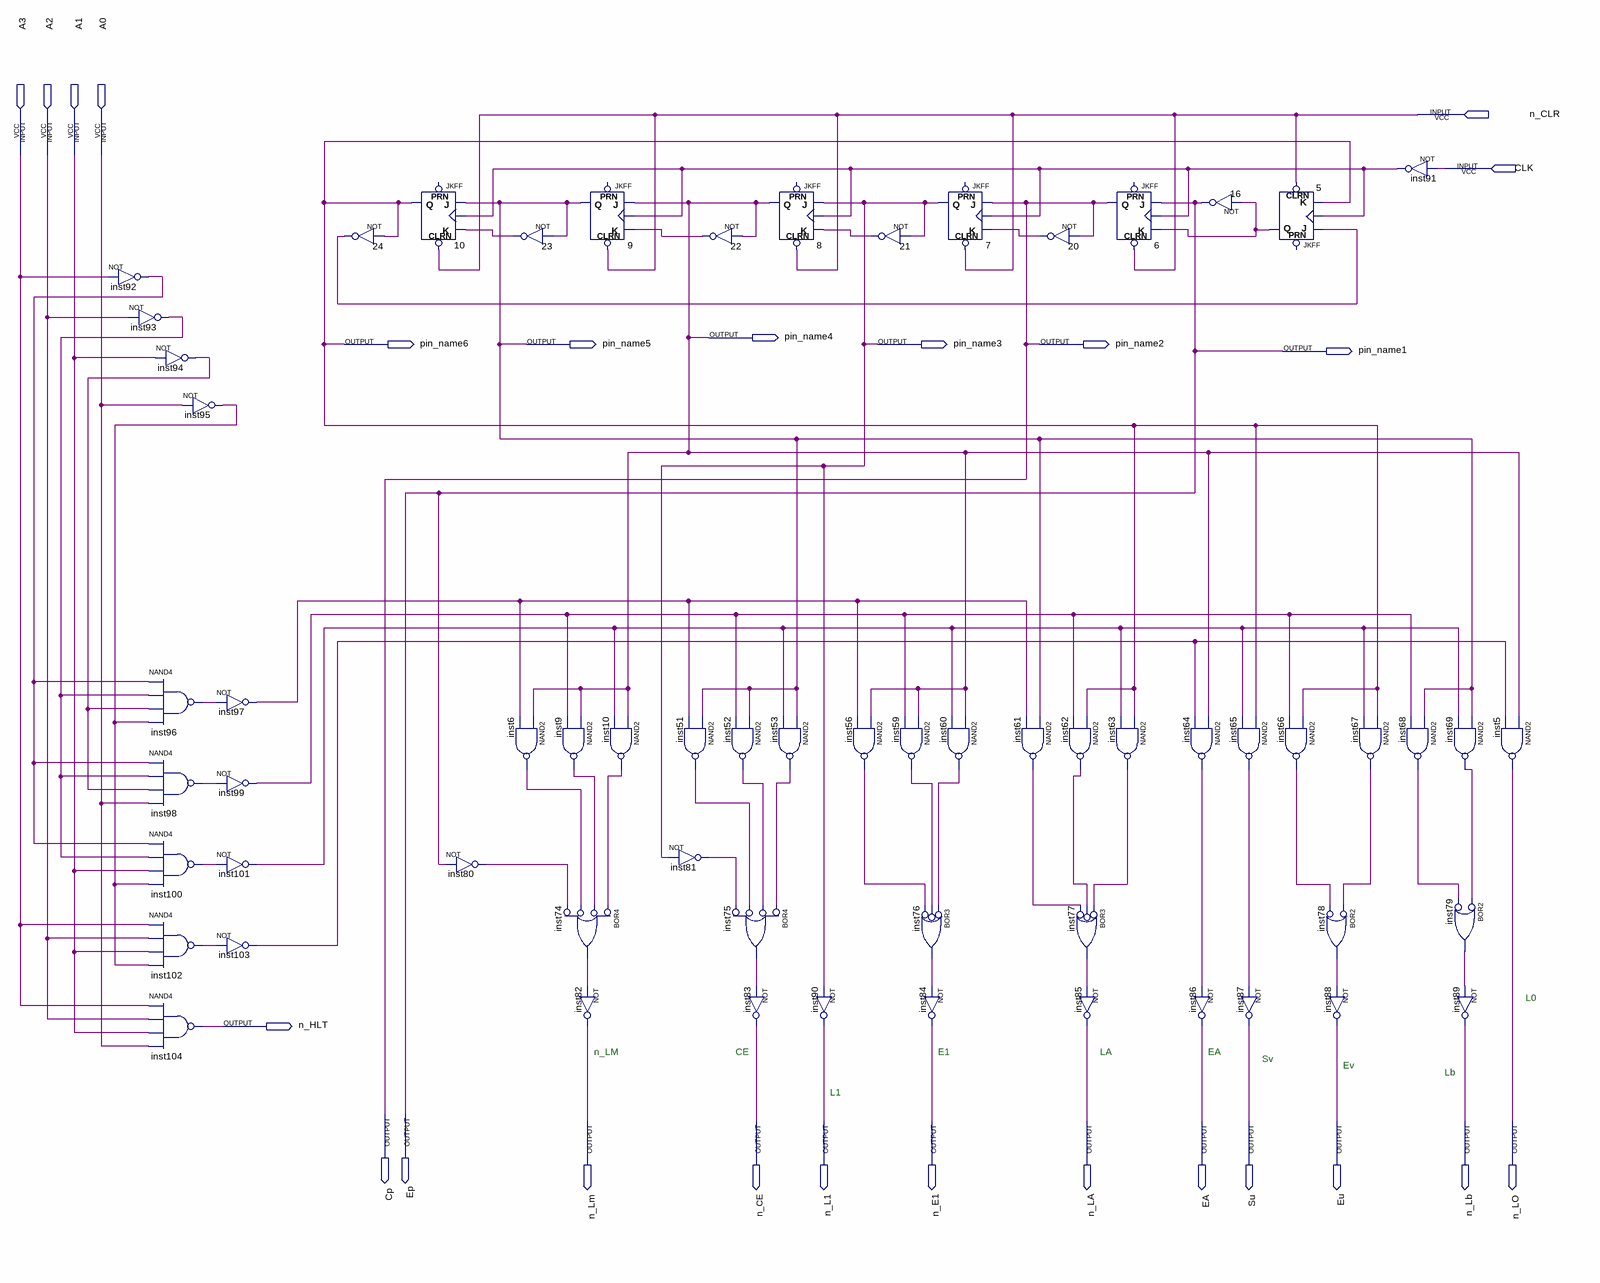
[diagram p0: schematic sheet]
// Quartus schematic CONTROLADOR.bdf as structural Verilog: 62 symbols, 25 pins
module CONTROLADOR (
  input  n_CLR,
  input  A3,
  input  A2,
  input  A1,
  input  A0,
  input  CLK,
  output pin_name4,
  output pin_name6,
  output pin_name5,
  output pin_name3,
  output pin_name2,
  output pin_name1,
  output n_HLT,
  output Cp,
  output Ep,
  output n_Lm,
  output n_CE,
  output n_L1,
  output n_E1,
  output n_LA,
  output EA,
  output Su,
  output Eu,
  output n_Lb,
  output n_LO
);

  wire inst6_out, inst9_out, inst10_out, inst51_out, inst52_out, inst53_out, inst56_out, inst59_out,
       inst60_out, inst61_out, inst62_out, inst63_out, inst64_out, inst65_out, inst66_out, inst67_out,
       inst68_out, inst69_out, inst74_out, inst75_out, inst76_out, inst77_out, inst78_out, inst79_out,
       inst80_out, inst81_out, inst91_out, inst92_out, inst93_out, inst94_out, inst95_out, inst96_out,
       inst97_out, inst98_out, inst99_out, inst100_out, inst101_out, inst102_out, inst103_out, n5_q, n20_out,
       n21_out, n22_out, n23_out, n24_out;

  not inst92 (inst92_out, A3);
  not inst93 (inst93_out, A2);
  not inst94 (inst94_out, A1);
  nand inst96 (inst96_out, inst92_out, inst93_out, inst94_out, inst95_out);
  nand inst98 (inst98_out, inst92_out, inst93_out, inst94_out, A0);
  nand inst100 (inst100_out, inst92_out, inst93_out, A1, inst95_out);
  nand inst102 (inst102_out, A3, A2, A1, inst95_out);
  nand inst104 (n_HLT, A3, A2, A1, A0);
  not inst95 (inst95_out, A0);
  not inst97 (inst97_out, inst96_out);
  not inst99 (inst99_out, inst98_out);
  not inst101 (inst101_out, inst100_out);
  not inst103 (inst103_out, inst102_out);
  not u_24 (n24_out, pin_name6);
  JKFF u_10 (.CLRN(n_CLR), .K(n23_out), .J(pin_name5), .CLK(inst91_out), .Q(pin_name6));  // open: PRN
  not inst80 (inst80_out, Ep);
  not u_23 (n23_out, pin_name5);
  nand inst6 (inst6_out, pin_name4, inst97_out);
  JKFF u_9 (.CLRN(n_CLR), .K(n22_out), .J(pin_name4), .CLK(inst91_out), .Q(pin_name5));  // open: PRN
  nand inst9 (inst9_out, pin_name4, inst99_out);
  nand inst10 (inst10_out, pin_name4, inst101_out);
  or inst74 (inst74_out, ~inst10_out, ~inst9_out, ~inst6_out, ~inst80_out);  // BOR4
  not inst82 (n_Lm, inst74_out);
  not u_22 (n22_out, pin_name4);
  nand inst51 (inst51_out, pin_name5, inst97_out);
  not inst81 (inst81_out, pin_name3);
  nand inst52 (inst52_out, pin_name5, inst99_out);
  or inst75 (inst75_out, ~inst53_out, ~inst52_out, ~inst51_out, ~inst81_out);  // BOR4
  not inst83 (n_CE, inst75_out);
  JKFF u_8 (.CLRN(n_CLR), .K(n21_out), .J(pin_name3), .CLK(inst91_out), .Q(pin_name4));  // open: PRN
  nand inst53 (inst53_out, pin_name5, inst101_out);
  not inst90 (n_L1, pin_name3);
  not u_21 (n21_out, pin_name3);
  nand inst56 (inst56_out, pin_name4, inst97_out);
  nand inst59 (inst59_out, pin_name4, inst99_out);
  or inst76 (inst76_out, ~inst60_out, ~inst59_out, ~inst56_out);  // BOR3
  not inst84 (n_E1, inst76_out);
  JKFF u_7 (.CLRN(n_CLR), .K(n20_out), .J(Cp), .CLK(inst91_out), .Q(pin_name3));  // open: PRN
  nand inst60 (inst60_out, pin_name4, inst101_out);
  nand inst61 (inst61_out, pin_name5, inst97_out);
  not u_20 (n20_out, Cp);
  nand inst62 (inst62_out, pin_name6, inst99_out);
  or inst77 (inst77_out, ~inst63_out, ~inst62_out, ~inst61_out);  // BOR3
  not inst85 (n_LA, inst77_out);
  JKFF u_6 (.CLRN(n_CLR), .K(n5_q), .J(Ep), .CLK(inst91_out), .Q(Cp));  // open: PRN
  nand inst63 (inst63_out, pin_name6, inst101_out);
  nand inst64 (inst64_out, pin_name4, inst103_out);
  not inst86 (EA, inst64_out);
  not u_16 (Ep, n5_q);
  nand inst65 (inst65_out, pin_name6, inst101_out);
  not inst87 (Su, inst65_out);
  JKFF u_5 (.CLRN(n_CLR), .K(pin_name6), .J(n24_out), .CLK(inst91_out), .Q(n5_q));  // open: PRN
  nand inst66 (inst66_out, pin_name6, inst99_out);
  nand inst67 (inst67_out, pin_name6, inst101_out);
  or inst78 (inst78_out, ~inst67_out, ~inst66_out);  // BOR2
  not inst88 (Eu, inst78_out);
  not inst91 (inst91_out, CLK);
  nand inst68 (inst68_out, pin_name5, inst99_out);
  nand inst69 (inst69_out, pin_name5, inst101_out);
  or inst79 (inst79_out, ~inst69_out, ~inst68_out);  // BOR2
  not inst89 (n_Lb, inst79_out);
  nand inst5 (n_LO, pin_name4, inst103_out);

  assign pin_name1 = Ep;
  assign pin_name2 = Cp;

  // Notes on the sheet:
  //   L0
  //   n_LM
  //   CE
  //   E1
  //   LA
  //   EA
  //   Sv
  //   Ev
  //   Lb
  //   L1
endmodule
